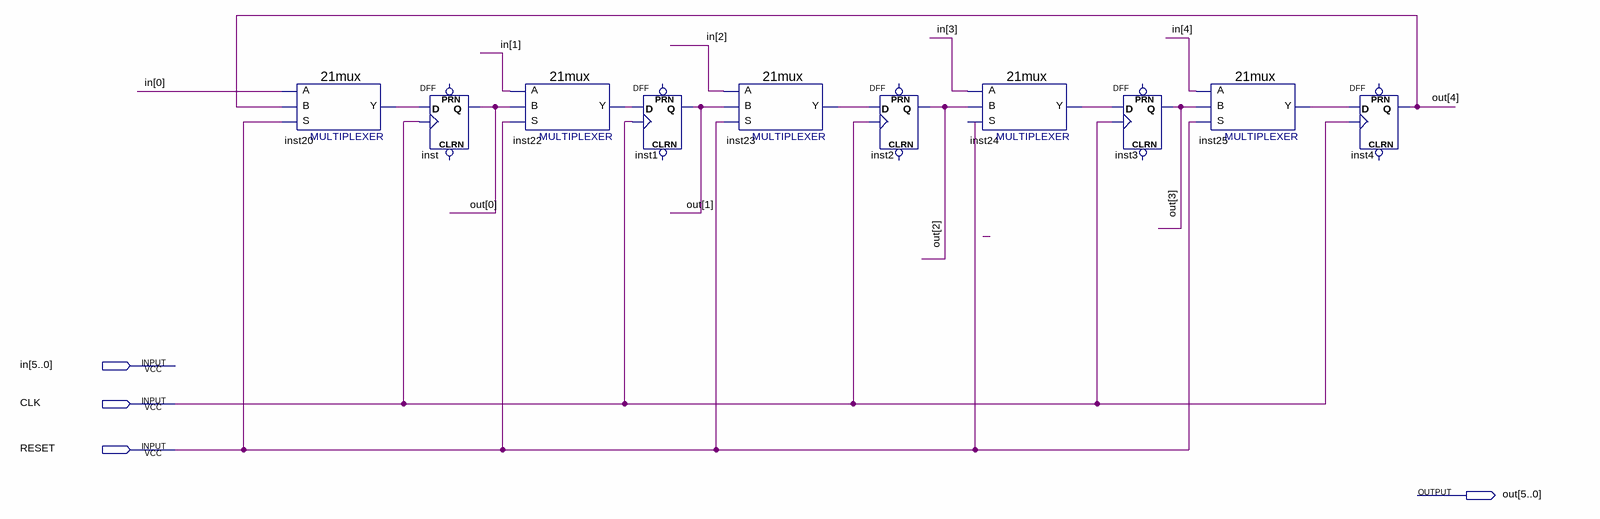
[diagram p0: schematic sheet]
// Quartus schematic ROR_without_amount.bdf as structural Verilog: 10 symbols, 4 pins
module ROR_without_amount (
  input  [5:0] in,
  input  CLK,
  input  RESET,
  output [5:0] out
);

  wire inst20_y, inst22_y, inst23_y, inst24_y, inst25_y;

  \21mux  inst20 (.S(RESET), .B(out[4]), .A(in[0]), .Y(inst20_y));
  DFF inst (.CLK(CLK), .D(inst20_y), .Q(out[0]));  // open: CLRN, PRN
  \21mux  inst22 (.S(RESET), .B(out[0]), .A(in[1]), .Y(inst22_y));
  DFF inst1 (.CLK(CLK), .D(inst22_y), .Q(out[1]));  // open: CLRN, PRN
  \21mux  inst23 (.S(RESET), .B(out[1]), .A(in[2]), .Y(inst23_y));
  DFF inst2 (.CLK(CLK), .D(inst23_y), .Q(out[2]));  // open: CLRN, PRN
  \21mux  inst24 (.S(RESET), .B(out[2]), .A(in[3]), .Y(inst24_y));
  DFF inst3 (.CLK(CLK), .D(inst24_y), .Q(out[3]));  // open: CLRN, PRN
  \21mux  inst25 (.S(RESET), .B(out[3]), .A(in[4]), .Y(inst25_y));
  DFF inst4 (.CLK(CLK), .D(inst25_y), .Q(out[4]));  // open: CLRN, PRN
endmodule
